# Altium schematic sheet 03_H7_PWR.SchDoc: =GlobalProjectName
size 594 x 420 mm; ApprovedBy: Галкин; CheckedBy: Галкин; Author: Данич; SheetNumber: 3; SheetTotal: 8; PageSetup: Record=PageOptions|CenterHorizontal=True|CenterVertical=True|PrintScale=0.70|XCorrection=1.00|YCorrection=1.00|PrintKind=2|BorderSize=5000000|LeftOffset=9000|BottomOffset=10100|Orientation=2|PaperLength=11176|PaperWidth=8636|Scale=100|PaperSource=259|PrintQuality=-3|MediaType=1|DitherType=10|PrintScaleMode=1|PaperKind=A3|PaperIndex=8
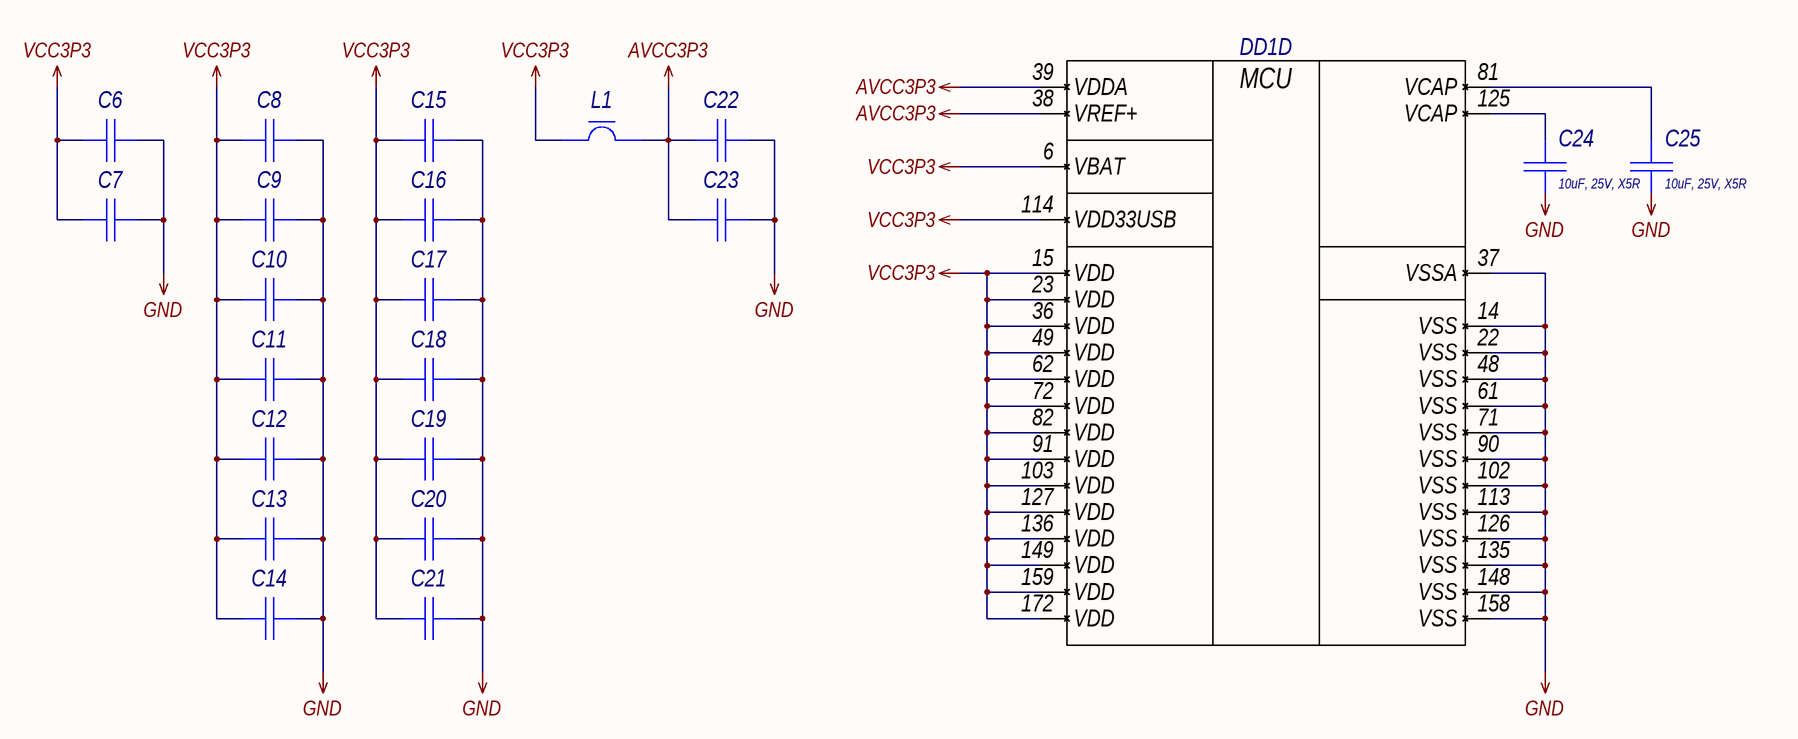
[diagram p0: 03_H7_PWR.SchDoc]

## Parts
C6  Capacitor  [C0402_L]  (value not drawn)
C7  Capacitor  [C0402_L]  (value not drawn)
C8  Capacitor  [C0402_L]  (value not drawn)
C9  Capacitor  [C0402_L]  (value not drawn)
C10  Capacitor  [C0402_L]  (value not drawn)
C11  Capacitor  [C0402_L]  (value not drawn)
C12  Capacitor  [C0402_L]  (value not drawn)
C13  Capacitor  [C0402_L]  (value not drawn)
C14  Capacitor  [C0402_L]  (value not drawn)
C15  Capacitor  [C0402_L]  (value not drawn)
C16  Capacitor  [C0402_L]  (value not drawn)
C17  Capacitor  [C0402_L]  (value not drawn)
C18  Capacitor  [C0402_L]  (value not drawn)
C19  Capacitor  [C0402_L]  (value not drawn)
C20  Capacitor  [C0402_L]  (value not drawn)
C21  Capacitor  [C0402_L]  (value not drawn)
C22  Capacitor  [C0402_L]  (value not drawn)
C23  Capacitor  [C0402_L]  (value not drawn)
C24  Schematic Value: 10uF, 25V, X5R  [C0805_L]  (hidden comment: Capacitor)
C25  Schematic Value: 10uF, 25V, X5R  [C0805_L]  (hidden comment: Capacitor)
DD1  STM32H743IxT6-Series  [LQFP-176_050P2400X2400X160_N]  (value not drawn)  (part D of 4)
L1  FerriteBead  [L0402_L]  (value not drawn)

## Nets
AVCC3P3: C22.1 C23.1 DD1.38(VREF+) DD1.39(VDDA) L1.2
GND: C6.2 C7.2 C8.2 C9.2 C10.2 C11.2 C12.2 C13.2 C14.2 C15.2 C16.2 C17.2 C18.2 C19.2 C20.2 C21.2 C22.2 C23.2 C24.1 C25.1 DD1.14(VSS) DD1.22(VSS) DD1.37(VSSA) DD1.48(VSS) DD1.61(VSS) DD1.71(VSS) DD1.90(VSS) DD1.102(VSS) DD1.113(VSS) DD1.126(VSS) DD1.135(VSS) DD1.148(VSS) DD1.158(VSS)
VCC3P3: C6.1 C7.1 C8.1 C9.1 C10.1 C11.1 C12.1 C13.1 C14.1 C15.1 C16.1 C17.1 C18.1 C19.1 C20.1 C21.1 DD1.6(VBAT) DD1.15(VDD) DD1.23(VDD) DD1.36(VDD) DD1.49(VDD) DD1.62(VDD) DD1.72(VDD) DD1.82(VDD) DD1.91(VDD) DD1.103(VDD) DD1.114(VDD33USB) DD1.127(VDD) DD1.136(VDD) DD1.149(VDD) DD1.159(VDD) DD1.172(VDD) L1.1
NetC24_2: C24.2 DD1.125(VCAP)
NetC25_2: C25.2 DD1.81(VCAP)

## Notes on the sheet
- Подп. и дата
- Инв. № дубл.
- Взам. инв. №
- Инв. № подл.
- Изм.
- Лист
- № докум.
- Подп.
- Дата
- Форма 2а ГОСТ 2.104-2006
- Копировал
- Формат А2
- (in symbol STM32H743IIT6, part D) MCU

## Library data of the parts
C6 C7 = GRM155R61A475MEAAD: Manufacturer: Murata; Type: Конденсатор; Schematic Value: 4.7uF, 10V, X5R; ID: 255; Value: 4.7uF; Voltage: 10V; Tolerance: ±20%; Dielectric Type: X5R; Application Category: 1; Working Temperature Min: -55°С; Working Temperature Max: +85°С; Published: 18.05.2010; Publisher: Andrew Danich; Part Number: GRM155R61A475MEAAD; Footprint: 0402
C8-C21 C23 = GCM155R71C104KA55D: Manufacturer: Murata; Type: Конденсатор; Schematic Value: 0.1uF, 16V, X7R; ID: 163; Value: 0.1uF; Voltage: 16V; Tolerance: ±10%; Dielectric Type: X7R; Application Category: 1; Working Temperature Min: -55°С; Working Temperature Max: +125°С; Functional Analog: GRM155R71C104KA88D; Published: 18.05.2010; Publisher: Andrew Danich; Part Number: GCM155R71C104KA55D; Footprint: 0402
C22 = GRM155C71A105KE11D: Manufacturer: Murata; Type: Конденсатор; Schematic Value: 1uF, 10V, X7S; ID: 179; Value: 1uF; Voltage: 10V; Tolerance: ±10%; Dielectric Type: X7S; Application Category: 1; Working Temperature Min: -55°С; Working Temperature Max: +125°С; Published: 18.05.2010; Publisher: Andrew Danich; Part Number: GRM155C71A105KE11D; Footprint: 0402
C24 C25 = GRM21BR61E106KA73L: Manufacturer: Murata; Type: Конденсатор; ID: 53; Value: 10uF; Voltage: 25V; Tolerance: ±10%; Dielectric Type: X5R; Application Category: 1; Published: 18.05.2010; Publisher: Andrew Danich; Part Number: GRM21BR61E106KA73L; Footprint: 0805
DD1 = STM32H743IIT6: Manufacturer: STMicroelectronics; ID: 36; Supply Operation: +1.62…3.6V; Flash: 2M; SRAM: 1M; Prog Interface: JTAG, SWD, UART, USB; I/O Lines: 140; Operation Frequency: 400MHz; Application Category: 1; Working Temperature Min: -40°С; Working Temperature Max: +85°С; Published: 19.05.2020; Publisher: Andrew Danich; Type: Микросхема; Part Number: STM32H743IIT6; Value: STM32H743IIT6
L1 = BLM15HD601SH1D: Manufacturer: Murata; Type: Дроссель; ID: 9; Rated Current: 300mA; Impedance at 100Mhz: 600ohm; Tolerance: ±25%; DC Resistance: 0.85ohm; Inductor Type: EMIFIL; Application Category: 1; Working Temperature Min: -55°С; Working Temperature Max: +125°С; Published: 14.11.2014; Publisher: Andrew Danich; Part Number: BLM15HD601SH1D; Value: BLM15HD601SH1D; Footprint: 0402